# EAGLE design vds_botboard_revB (EAGLE 8.5.1)
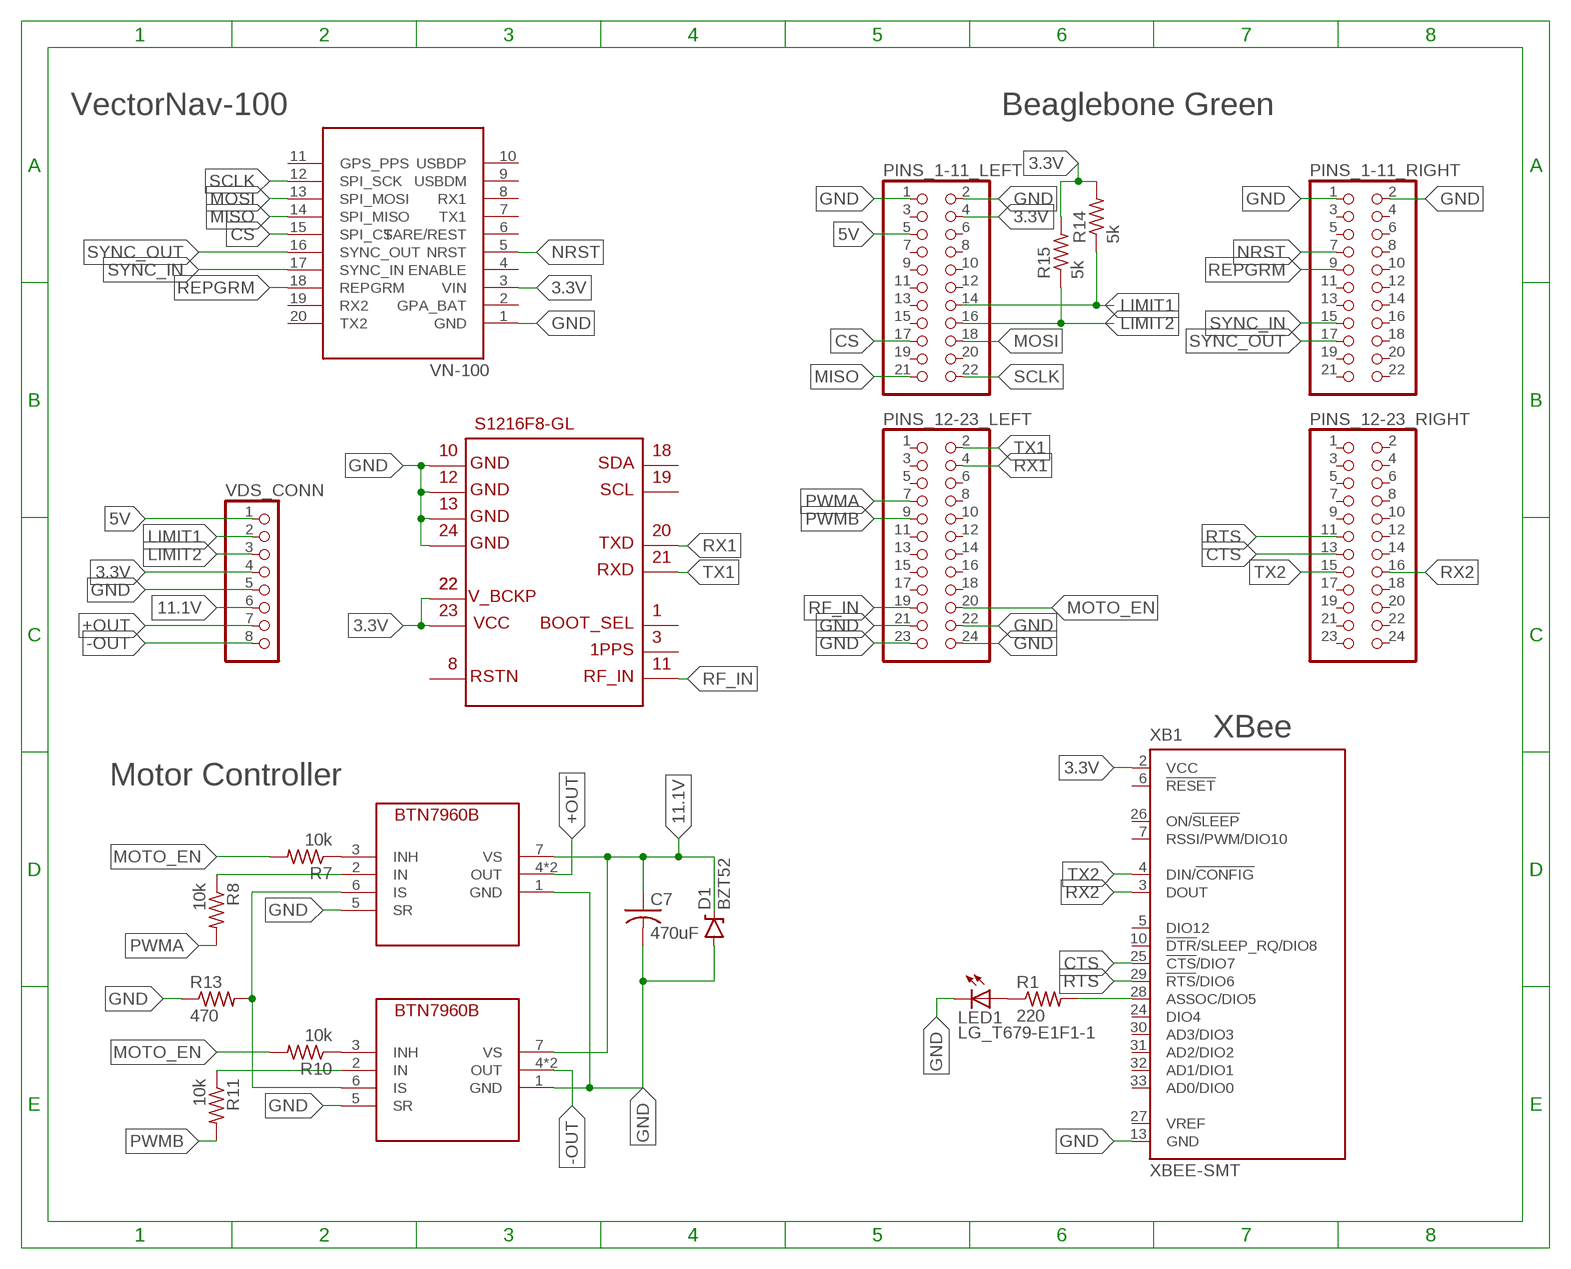
[diagram p0: schematic, sheet 1]

## Parts
C7  470uF  C-US050-024X044  [C050-024X044]
D1  BZT52  DIODE-ZENER  [DIODE-BZT52]
JM1  S1216F8-GL  [S1216F8-GL]
LED1  LG_T679-E1F1-1  [PLCC2]
PINS_1-11_LEFT  PINHD-2X11  [2X11]
PINS_1-11_RIGHT  PINHD-2X11  [2X11]
PINS_12-23_LEFT  PINHD-2X12  [2X12]
PINS_12-23_RIGHT  PINHD-2X12  [2X12]
R1  220  R-US_0204/5  [0204/5]
R7  10k  R-US_0204/5  [0204/5]
R8  10k  R-US_0204/5  [0204/5]
R10  10k  R-US_0204/5  [0204/5]
R11  10k  R-US_0204/5  [0204/5]
R13  470  R-US_0204/5  [0204/5]
R14  5k  R-US_0204/5  [0204/5]
R15  5k  R-US_0204/5  [0204/5]
U1  INF-PG-TO263-7-1_L_1_BTN7960B  [INF-PG-TO263-7-1_L_1PRIMARY]
U2  INF-PG-TO263-7-1_L_1_BTN7960B  [INF-PG-TO263-7-1_L_1PRIMARY]
VDS_CONN  PINHD-1X8  [1X08]
VN1  VECTORNAV-100  [VN-100]
XB1  XBEE-SMT  [XBEE-SMT]

## Nets
3.3V: JM1.22 JM1.23 PINS_1-11_LEFT.4 R14.2 R15.2 VDS_CONN.4 VN1.3(VIN) XB1.2(VCC)
5V: PINS_1-11_LEFT.5 VDS_CONN.1
11.1V: C7.1 D1.C U1.7(VS) U2.7(VS) VDS_CONN.6
+OUT: U1.4(OUT) U1.8(OUT) VDS_CONN.7
-OUT: U2.4(OUT) U2.8(OUT) VDS_CONN.8
COMM: R1.2 XB1.28(ASSOC/DIO5)
CS: PINS_1-11_LEFT.17 VN1.15(SPI_CS)
CTS: PINS_12-23_RIGHT.13 XB1.25(!CTS!/DIO7)
GND: C7.2 D1.A JM1.10 JM1.12 JM1.13 JM1.24 LED1.C PINS_1-11_LEFT.1 PINS_1-11_LEFT.2 PINS_1-11_RIGHT.1 PINS_1-11_RIGHT.2 PINS_12-23_LEFT.21 PINS_12-23_LEFT.22 PINS_12-23_LEFT.23 PINS_12-23_LEFT.24 R13.1 U1.1(GND) U1.5(SR) U2.1(GND) U2.5(SR) VDS_CONN.5 VN1.1(GND) XB1.13(GND)
IS: R13.2 U1.6(IS) U2.6(IS)
LIMIT1: PINS_1-11_LEFT.14 R14.1 VDS_CONN.2
LIMIT2: PINS_1-11_LEFT.16 R15.1 VDS_CONN.3
MISO: PINS_1-11_LEFT.21 VN1.14(SPI_MISO)
MOSI: PINS_1-11_LEFT.18 VN1.13(SPI_MOSI)
MOTO_EN: PINS_12-23_LEFT.20 R7.2 R10.2
N$1: LED1.A R1.1
N$7: R7.1 U1.3(INH)
N$8: R8.1 U1.2(IN)
N$9: R10.1 U2.3(INH)
N$10: R11.1 U2.2(IN)
NRST: PINS_1-11_RIGHT.7 VN1.5(NRST)
PWMA: PINS_12-23_LEFT.7 R8.2
PWMB: PINS_12-23_LEFT.9 R11.2
REPGRM: PINS_1-11_RIGHT.9 VN1.18(REPGRM)
RF_IN: JM1.11 PINS_12-23_LEFT.19
RTS: PINS_12-23_RIGHT.11 XB1.29(!RTS!/DIO6)
RX1: JM1.20 PINS_12-23_LEFT.4
RX2: PINS_12-23_RIGHT.16 XB1.3(DOUT)
SCLK: PINS_1-11_LEFT.22 VN1.12(SPI_SCK)
SYNC_IN: PINS_1-11_RIGHT.15 VN1.17(SYNC_IN)
SYNC_OUT: PINS_1-11_RIGHT.17 VN1.16(SYNC_OUT)
TX1: JM1.21 PINS_12-23_LEFT.2
TX2: PINS_12-23_RIGHT.15 XB1.4(DIN/!CONFIG)
Unconnected: JM1.1 JM1.3 JM1.8 JM1.18 JM1.19 PINS_1-11_LEFT.3 PINS_1-11_LEFT.6 PINS_1-11_LEFT.7 PINS_1-11_LEFT.8 PINS_1-11_LEFT.9 PINS_1-11_LEFT.10 PINS_1-11_LEFT.11 PINS_1-11_LEFT.12 PINS_1-11_LEFT.13 PINS_1-11_LEFT.15 PINS_1-11_LEFT.19 PINS_1-11_LEFT.20 PINS_1-11_RIGHT.3 PINS_1-11_RIGHT.4 PINS_1-11_RIGHT.5 PINS_1-11_RIGHT.6 PINS_1-11_RIGHT.8 PINS_1-11_RIGHT.10 PINS_1-11_RIGHT.11 PINS_1-11_RIGHT.12 PINS_1-11_RIGHT.13 PINS_1-11_RIGHT.14 PINS_1-11_RIGHT.16 PINS_1-11_RIGHT.18 PINS_1-11_RIGHT.19 PINS_1-11_RIGHT.20 PINS_1-11_RIGHT.21 PINS_1-11_RIGHT.22 PINS_12-23_LEFT.1 PINS_12-23_LEFT.3 PINS_12-23_LEFT.5 PINS_12-23_LEFT.6 PINS_12-23_LEFT.8 PINS_12-23_LEFT.10 PINS_12-23_LEFT.11 PINS_12-23_LEFT.12 PINS_12-23_LEFT.13 PINS_12-23_LEFT.14 PINS_12-23_LEFT.15 PINS_12-23_LEFT.16 PINS_12-23_LEFT.17 PINS_12-23_LEFT.18 PINS_12-23_RIGHT.1 PINS_12-23_RIGHT.2 PINS_12-23_RIGHT.3 PINS_12-23_RIGHT.4 PINS_12-23_RIGHT.5 PINS_12-23_RIGHT.6 PINS_12-23_RIGHT.7 PINS_12-23_RIGHT.8 PINS_12-23_RIGHT.9 PINS_12-23_RIGHT.10 PINS_12-23_RIGHT.12 PINS_12-23_RIGHT.14 PINS_12-23_RIGHT.17 PINS_12-23_RIGHT.18 PINS_12-23_RIGHT.19 PINS_12-23_RIGHT.20 PINS_12-23_RIGHT.21 PINS_12-23_RIGHT.22 PINS_12-23_RIGHT.23 PINS_12-23_RIGHT.24 VN1.2(GPA_BAT) VN1.4(ENABLE) VN1.6(TARE/REST) VN1.7(TX1) VN1.8(RX1) VN1.9(USBDM) VN1.10(USBDP) VN1.11(GPS_PPS) VN1.19(RX2) VN1.20(TX2) XB1.5(DIO12) XB1.6(!RESET) XB1.7(RSSI/PWM/DIO10) XB1.10(!DTR!/SLEEP_RQ/DIO8) XB1.24(DIO4) XB1.26(ON/!SLEEP) XB1.27(VREF) XB1.30(AD3/DIO3) XB1.31(AD2/DIO2) XB1.32(AD1/DIO1) XB1.33(AD0/DIO0)

## Notes on the sheet
- VectorNav-100 | Beaglebone Green
- XBee
- Motor Controller

## Library data of the parts
C7 = adafruit:C-US: CAPACITOR, American symbol
D1 = SparkFun-DiscreteSemi:DIODE-ZENER: Zener Diode Production Part - 8199 3.4V Zener Voltage; PROD-ID: DIO-08199
JM1 = S1216F8-GL:S1216F8-GL
LED1 = led:*_T679-?-1: LC TOPLED® Low Current LED Source: http://catalog.osram-os.com .. LG_LS_LY_T679_OBS.pdf; COLOR: green
PINS_1-11_LEFT PINS_1-11_RIGHT = pinhead:PINHD-2X11: PIN HEADER
PINS_12-23_LEFT PINS_12-23_RIGHT = pinhead:PINHD-2X12: PIN HEADER
R1 = resistor:R-US_: RESISTOR, American symbol
R7 R8 R10 R11 R13-R15 = adafruit:R-US_: RESISTOR, American symbol
U1 U2 = INF-PG-TO263-7-1L:INF-PG-TO263-7-1_L_1
VDS_CONN = pinhead:PINHD-1X8: PIN HEADER
VN1 = Vectornav-100_Breakout:VECTORNAV-100
XB1 = xbee:XBEE-SMT: XBee(TM)/XBee-PRO(TM) ZB SMT RF Modules. Source: Digi (90002002_a.pdf) (http://www.digi.com/products/wireless-wired-embedded-solutions/zigbee-rf-modules/zigbee-mesh-module/xbee-smt.jsp#overview)

## Net classes
0 default: width 1.016 mm, drill 0.508 mm, clearance 1.016 mm

## Board
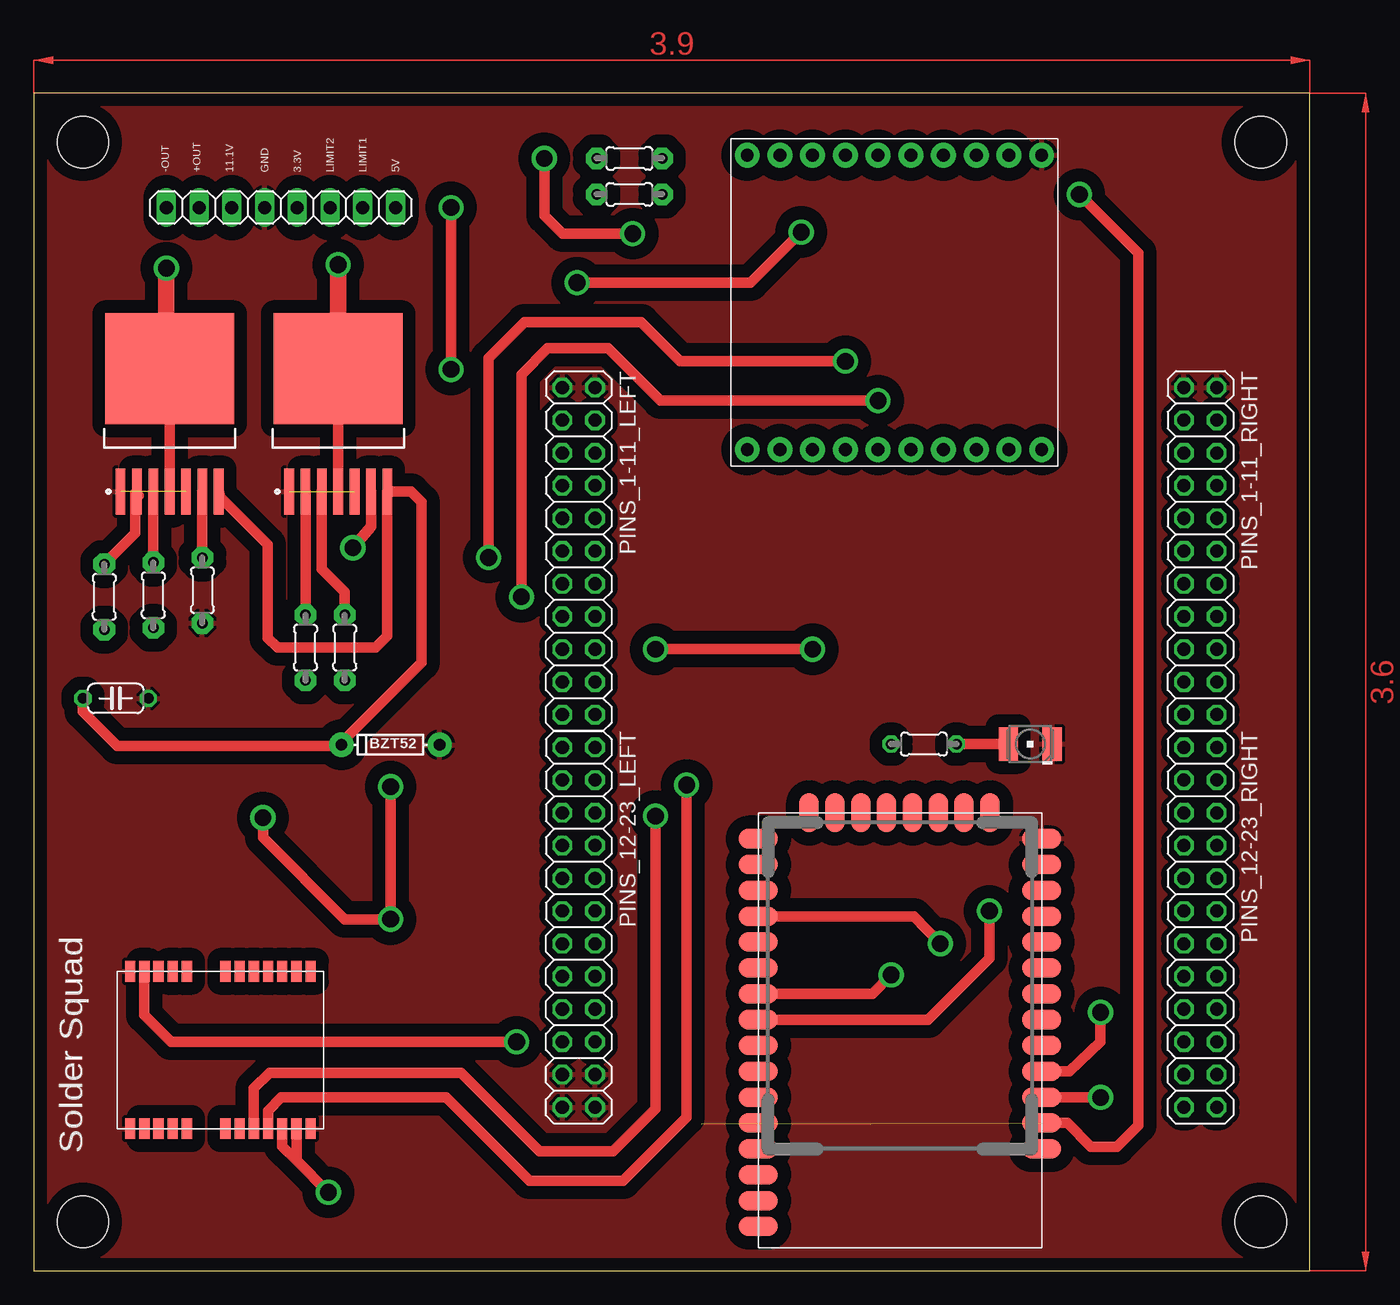
[diagram p1: board, top side]
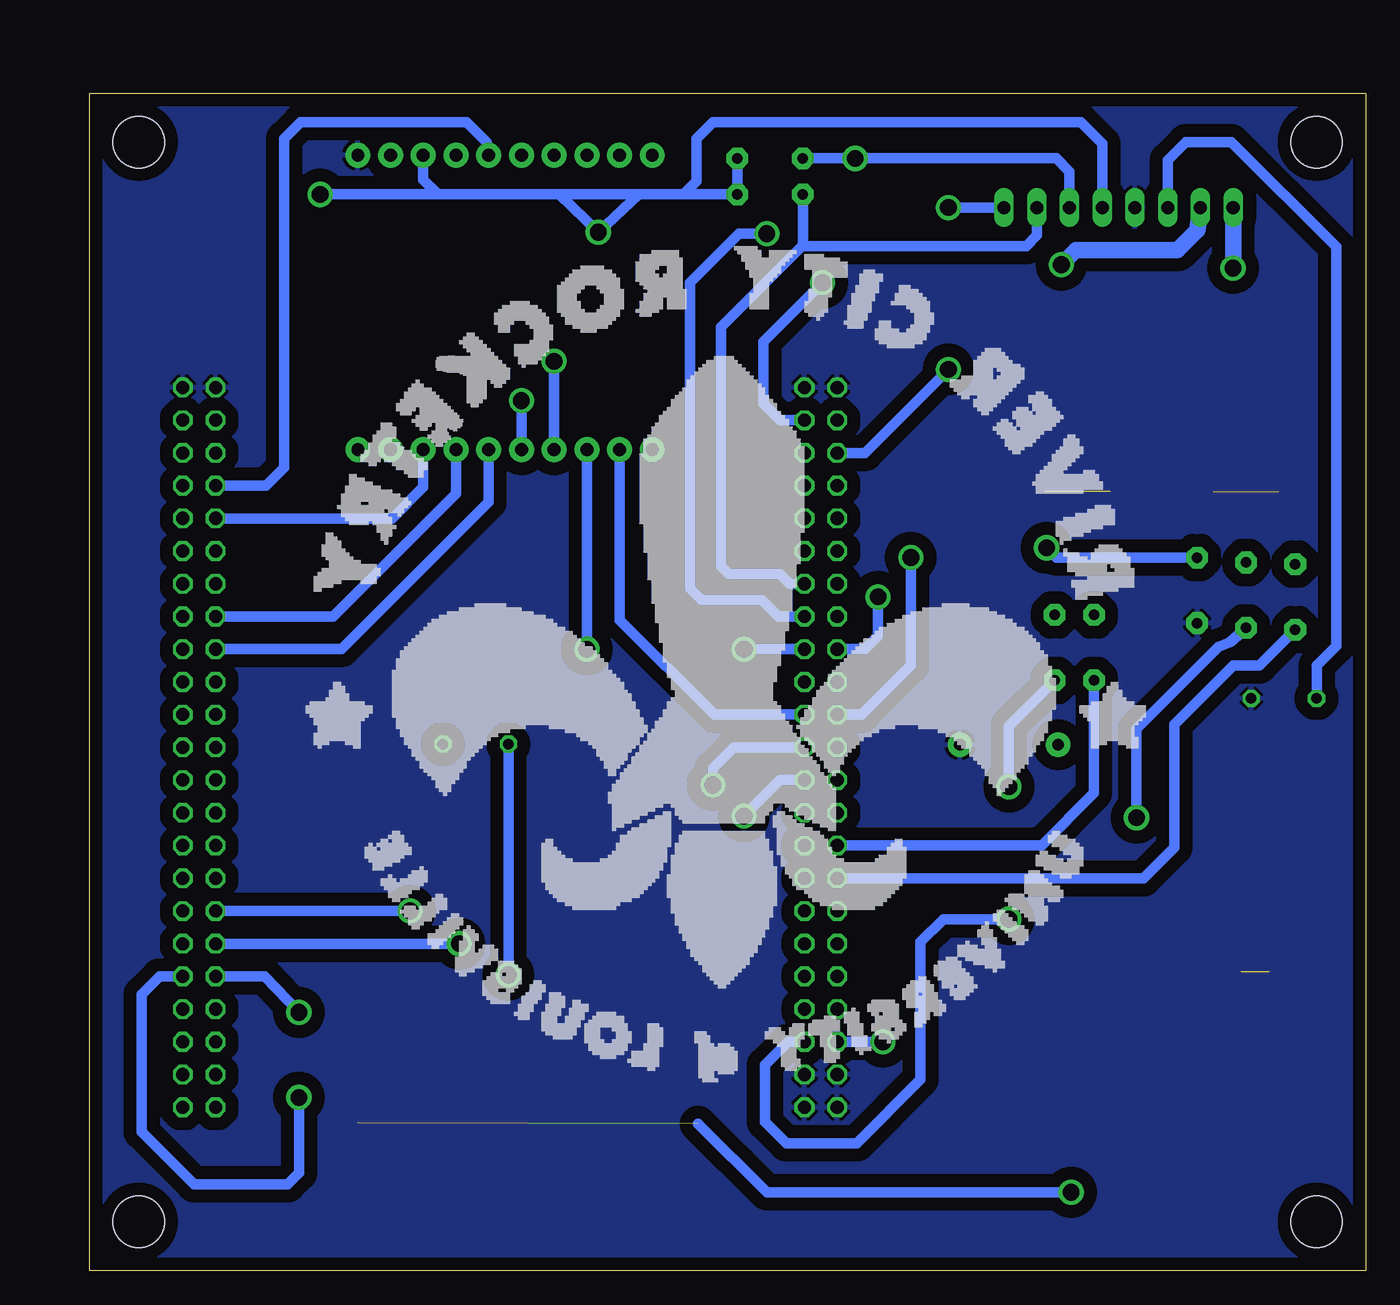
[diagram p2: board, bottom side, seen from below]

Size 99.06 x 91.44 mm. Coordinates in mm from the lower left corner, seen from the top.
Outline: 0,0 99.06,0 99.06,91.44 0,91.44 0,0
Copper layers (1*16): Top 0.035mm / dielectric 1.5mm / Bottom 0.035mm
Design rules "default *": minimum track width 10mil, minimum drill 20mil, track to track 10mil, track to pad 10mil, pad to pad 10mil, via to via 5mil, smd to smd 10mil, copper to edge 40mil, drill to drill 8mil, minimum pad ring 10mil, minimum via ring 8mil, stop-mask expansion 4mil, vias tented up to drill 0mil, thermal gap 10mil
Holes 4 mm at 3.81,87.63 95.25,87.63 3.81,3.81 95.25,3.81

### Footprints (pad centres in the part's own frame; a part is rotated, then mirrored left to right if it is on the bottom)
C050-024X044 = drill 0.813 octagon: 1 -2.54,0; 2 2.54,0
DIODE-BZT52 = drill 0.9 pad 1.88: A -3.81,0; C 3.81,0
S1216F8-GL = smd 1.6 x 0.8: 1 12.2,1; 2 12.2,2.1; 3 12.2,3.2; 4 12.2,4.3; 5 12.2,5.4; 6 12.2,6.5; 7 12.2,7.6; 8 12.2,10.6; 9 12.2,11.7; 10 12.2,12.8; 11 12.2,13.9; 12 12.2,15; 13 0,15; 14 0,13.9; 15 0,12.8; 16 0,11.7; 17 0,10.6; 18 0,7.6; 19 0,6.5; 20 0,5.4; 21 0,4.3; 22 0,3.2; 23 0,2.1; 24 0,1
PLCC2 = smd 2.6 x 1.5: A 0,1.7; C 0,-1.7
2X11 = drill 1.016 octagon: 1 -12.7,-1.27; 2 -12.7,1.27; 3 -10.16,-1.27; 4 -10.16,1.27; 5 -7.62,-1.27; 6 -7.62,1.27; 7 -5.08,-1.27; 8 -5.08,1.27; 9 -2.54,-1.27; 10 -2.54,1.27; 11 0,-1.27; 12 0,1.27; 13 2.54,-1.27; 14 2.54,1.27; 15 5.08,-1.27; 16 5.08,1.27; 17 7.62,-1.27; 18 7.62,1.27; 19 10.16,-1.27; 20 10.16,1.27; 21 12.7,-1.27; 22 12.7,1.27
2X12 = drill 1.016 octagon: 1 -13.97,-1.27; 2 -13.97,1.27; 3 -11.43,-1.27; 4 -11.43,1.27; 5 -8.89,-1.27; 6 -8.89,1.27; 7 -6.35,-1.27; 8 -6.35,1.27; 9 -3.81,-1.27; 10 -3.81,1.27; 11 -1.27,-1.27; 12 -1.27,1.27; 13 1.27,-1.27; 14 1.27,1.27; 15 3.81,-1.27; 16 3.81,1.27; 17 6.35,-1.27; 18 6.35,1.27; 19 8.89,-1.27; 20 8.89,1.27; 21 11.43,-1.27; 22 11.43,1.27; 23 13.97,-1.27; 24 13.97,1.27
0204/5 = drill 0.813 octagon: 1 -2.54,0; 2 2.54,0
0204/5' = drill 0.813 pad 1.676 octagon: 1 -2.54,0; 2 2.54,0
INF-PG-TO263-7-1_L_1PRIMARY = smd 3.55 x 0.75: 1 -6.05,3.81; 2 -6.05,2.54; 3 -6.05,1.27; 4 -6.05,0; 5 -6.05,-1.27; 6 -6.05,-2.54; 7 -6.05,-3.81 | smd 8.6 x 10: 8 3.5,0
1X08 = drill 1.016 long: 1 -8.89,0; 2 -6.35,0; 3 -3.81,0; 4 -1.27,0; 5 1.27,0; 6 3.81,0; 7 6.35,0; 8 8.89,0
VN-100 = drill 1 pad 1.93: 1 24.13,1.27; 2 24.13,3.81; 3 24.13,6.35; 4 24.13,8.89; 5 24.13,11.43; 6 24.13,13.97; 7 24.13,16.51; 8 24.13,19.05; 9 24.13,21.59; 10 24.13,24.13; 11 1.27,24.13; 12 1.27,21.59; 13 1.27,19.05; 14 1.27,16.51; 15 1.27,13.97; 16 1.27,11.43; 17 1.27,8.89; 18 1.27,6.35; 19 1.27,3.81; 20 1.27,1.27
XBEE-SMT = smd 3.048 x 1.524: 1 0,26.086; 2 0,24.079; 3 0,22.073; 4 0,20.066; 5 0,18.059; 6 0,16.053; 7 0,14.046; 8 0,12.04; 9 0,10.033; 10 0,8.026; 11 0,6.02; 12 0,4.013; 13 0,2.007; 22 21.996,2.007; 23 21.996,4.013; 24 21.996,6.02; 25 21.996,8.026; 26 21.996,10.033; 27 21.996,12.04; 28 21.996,14.046; 29 21.996,16.053; 30 21.996,18.059; 31 21.996,20.066; 32 21.996,22.073; 33 21.996,24.079; 34 21.996,26.086; 35 21.996,28.092; 36 21.996,30.099; 37 21.996,32.106 | smd 1.524 x 3.048: 14 4.013,0; 15 6.02,0; 16 8.026,0; 17 10.033,0; 18 12.04,0; 19 14.046,0; 20 16.053,0; 21 18.059,0

### Placement (x,y rotation side)
C7  6.35,44.45 0 top
D1  27.69,40.84 180 top
JM1  22.48,11.05 90 top
LED1  77.34,40.89 90 top
PINS_1-11_LEFT  42.29,55.88 270 top
PINS_1-11_RIGHT  90.55,55.88 270 top
PINS_12-23_LEFT  42.29,26.67 270 top
PINS_12-23_RIGHT  90.55,26.67 270 top
R1  69.09,40.89 180 top
R7  10k  [0204/5']  24.13,48.39 270 top
R8  10k  [0204/5']  21.08,48.39 270 top
R10  10k  [0204/5']  9.27,52.45 270 top
R11  10k  [0204/5']  5.46,52.32 270 top
R13  470  [0204/5']  13.08,52.83 90 top
R14  5k  [0204/5']  46.23,83.57 0 top
R15  5k  [0204/5']  46.23,86.36 0 top
U1  23.62,66.55 90 top
U2  10.54,66.55 90 top
VDS_CONN  19.18,82.55 180 top
VN1  79.5,62.48 90 top
XB1  78.23,35.56 180 top

### Tracks (layer width: path | path; a pad name or v marks a point on that pad's centre or on a via)
3.3V  (via drill 1.3 pad 1.95)  (1 unrouted)
  Top 0.813: XB1.2 80.21,11.48 82.04,9.65 84.07,9.65 85.72,11.3 85.72,78.99 v81.15,83.57 | 20.38,8.58 JM1.23 | 20.38,8.58 v22.86,6.1 | JM1.22 19.28,9.68 20.38,8.58 | v42.16,76.71 55.63,76.71 v59.56,80.64
  Bottom 0.813: R15.2 R14.2 52.96,83.57 | 56.39,83.57 62.61,83.57 | 56.39,83.57 52.96,83.57 | 62.61,83.57 72.01,83.57 | 72.01,83.57 73.15,84.71 VN1.3 | 72.01,83.57 v81.15,83.57 | VDS_CONN.4 20.45,87.5 22.1,89.15 50.67,89.15 51.94,87.88 51.94,84.58 52.96,83.57 | v22.86,6.1 46.48,6.1 51.82,11.43 | PINS_1-11_LEFT.4 45.47,66.04 46.74,67.31 46.74,72.14 v42.16,76.71 | 62.61,83.57 v59.56,80.64 56.39,83.57
5V  (via drill 1.3 pad 1.95)
  Top 0.813: v32.38,82.55 v32.38,69.98
  Bottom 0.813: v32.38,69.98 38.86,63.5 PINS_1-11_LEFT.5 | VDS_CONN.1 v32.38,82.55
11.1V
  Top 0.813: 27.45,60.52 U1.7 | U2.7 14.48,60.07 18.16,56.39 18.16,49.15 18.92,48.39 26.54,48.39 27.43,49.28 U1.7 | U1.7 29.29,60.5 30.1,59.69 30.1,47.24 23.88,41.02 D1.C 23.8,40.77 6.48,40.77 3.81,43.43 C7.1
  Bottom 0.813: 23.8,40.77 D1.C | C7.1 3.81,46.99 2.29,48.51 2.29,79.5 10.41,87.63 13.97,87.63 15.37,86.23 VDS_CONN.6
+OUT  (via drill 1.3 pad 1.95)
  Top 0.813: U1.8 U1.4
  Top 1.27: v23.62,78.11 U1.8
  Bottom 1.27: v23.62,78.11 22.48,79.25 14.61,79.25 13.08,80.77 VDS_CONN.7
-OUT  (via drill 1.3 pad 1.95)
  Top 0.813: U2.8 U2.4
  Top 1.27: v10.29,77.85 10.29,73.91 U2.8
  Bottom 1.27: v10.29,77.85 VDS_CONN.8
COMM  (via drill 1.3 pad 1.95)
  Top 0.813: XB1.28 65.08,21.51 v66.55,22.99
  Bottom 0.813: v66.55,22.99 R1.2
CS  (via drill 1.3 pad 1.95)
  Top 0.813: v37.85,52.32 37.85,69.6 39.88,71.63 44.58,71.63 48.64,67.56 v65.53,67.56
  Bottom 0.813: VN1.15 v65.53,67.56 | v37.85,52.32 37.85,49.28 38.86,48.26 PINS_1-11_LEFT.17
CTS  (via drill 1.3 pad 1.95)
  Top 0.813: XB1.25 68.3,27.53 v70.36,25.4
  Bottom 0.813: v70.36,25.4 PINS_12-23_RIGHT.13
GND  (3 unrouted)
  pour Top: 0,91.44 0,0 99.06,0 99.06,91.44
  pour Bottom: 0,91.44 0,0 99.06,0 99.06,91.44
  pour Top: 0,91.44 99.31,91.44 99.31,0 0,0
  pour Bottom: 0,91.31 99.19,91.31 99.19,0 0,0
IS  (via drill 1.3 pad 1.95)
  Top 0.813: U1.6 26.16,57.78 v24.77,56.13 | U2.6 R13.2
  Bottom 0.813: R13.2 24,55.37 v24.77,56.13
LIMIT1
  Bottom 0.813: R14.1 43.69,79.63 43.75,79.57 | PINS_1-11_LEFT.14 44.7,53.34 45.47,54.1 49.4,54.1 50.04,54.74 50.04,73.28 43.75,79.57 | VDS_CONN.2 25.53,80.39 26.35,79.57 43.75,79.57
LIMIT2  (via drill 1.3 pad 1.95)
  Top 0.813: v46.48,80.52 41.02,80.52 39.62,81.92 v39.62,86.36
  Bottom 0.813: PINS_1-11_LEFT.16 45.59,50.8 46.86,52.07 51.56,52.07 52.45,52.96 52.45,76.71 48.64,80.52 v46.48,80.52 | VDS_CONN.3 22.99,85.34 24,86.36 v39.62,86.36 R15.1
MISO  (via drill 1.3 pad 1.95)
  Top 0.813: v35.31,55.37 35.31,70.87 38.1,73.66 47.12,73.66 50.16,70.61 v62.99,70.61
  Bottom 0.813: VN1.14 v62.99,70.61 | PINS_1-11_LEFT.21 39.12,43.18 35.31,46.99 v35.31,55.37
MOSI  (via drill 1.3 pad 1.95)
  Top 0.813: v60.45,48.26 v48.26,48.26
  Bottom 0.813: VN1.13 v60.45,48.26 | v48.26,48.26 PINS_1-11_LEFT.18
MOTO_EN  (via drill 1.3 pad 1.95)
  Top 0.813: v17.78,35.18 17.78,33.66 24.13,27.3 v27.69,27.3 v27.69,37.59
  Bottom 0.813: v17.78,35.18 17.78,42.08 11.43,48.44 10.49,48.82 R10.2 | R7.2 27.69,42.29 v27.69,37.59 | v27.69,27.3 32.77,27.3 34.54,25.53 34.54,14.86 39.5,9.91 44.96,9.91 46.61,11.56 46.61,16 44.83,17.78 PINS_12-23_LEFT.20
N$1
  Top 0.813: R1.1 LED1.A
N$7
  Top 0.813: U1.3 22.35,54.48 24.13,52.7 R7.1
N$8
  Top 0.813: U1.2 R8.1
N$9
  Top 0.813: U2.3 R10.1
N$10
  Top 0.152: U2.2 7.87,60.37
  Top 0.813: U2.2 8.13,60.2 | 7.87,60.37 7.87,57.28 R11.1
NRST
  Bottom 0.813: VN1.5 68.22,86.77 68.22,87.6 69.78,89.15 82.68,89.15 83.95,87.88 83.95,62.36 85.34,60.96 PINS_1-11_RIGHT.7
PWMA
  Bottom 0.813: PINS_12-23_LEFT.7 25.15,33.02 21.08,37.08 R8.2
PWMB
  Bottom 0.813: PINS_12-23_LEFT.9 17.27,30.48 14.86,32.89 14.86,42.42 10.29,46.99 8.26,46.99 R11.2
REPGRM
  Bottom 0.813: VN1.18 73.15,60.83 75.56,58.42 PINS_1-11_RIGHT.9
RF_IN  (via drill 1.3 pad 1.95)
  Top 0.813: JM1.11 8.58,19.87 10.67,17.78 v37.47,17.78
  Bottom 0.813: v37.47,17.78 PINS_12-23_LEFT.19
RTS  (via drill 1.3 pad 1.95)
  Top 0.813: XB1.29 69.42,19.51 74.17,24.26 v74.17,27.94
  Bottom 0.813: v74.17,27.94 PINS_12-23_RIGHT.11
RX1  (via drill 1.3 pad 1.95)
  Top 0.813: JM1.20 17.08,14.16 18.29,15.37 33.15,15.37 39.24,9.27 44.96,9.27 48.26,12.57 v48.26,35.31
  Bottom 0.813: v48.26,35.31 45.47,38.1 PINS_12-23_LEFT.4
RX2  (via drill 1.3 pad 1.95)
  Top 0.813: XB1.3 78.77,13.46 v82.8,13.46
  Bottom 0.813: PINS_12-23_RIGHT.16 93.6,22.86 95,21.46 95,10.79 90.93,6.73 83.69,6.73 82.8,7.62 v82.8,13.46
SCLK
  Bottom 0.813: VN1.12 57.91,50.55 50.55,43.18 PINS_1-11_LEFT.22
SYNC_IN
  Bottom 0.813: VN1.17 70.61,60.33 80.14,50.8 PINS_1-11_RIGHT.15
SYNC_OUT
  Bottom 0.813: VN1.16 68.07,59.69 79.5,48.26 PINS_1-11_RIGHT.17
TX1  (via drill 1.3 pad 1.95)
  Top 0.813: v50.67,37.72 50.67,11.94 45.72,6.99 38.48,6.99 32,13.46 19.18,13.46 18.18,12.43 JM1.21
  Bottom 0.813: v50.67,37.72 50.67,38.99 49.02,40.64 PINS_12-23_LEFT.2
TX2  (via drill 1.3 pad 1.95)
  Top 0.813: XB1.4 80.39,15.49 82.8,17.78 v82.8,20.07
  Bottom 0.813: v82.8,20.07 85.47,22.86 PINS_12-23_RIGHT.15
(copper drawn outside any net)
  shapes: Top area x2

### Text on the board
tPlace: -OUT | +OUT | 11.1V | GND | 3.3V | LIMIT2 | LIMIT1 | 5V | Solder Squad